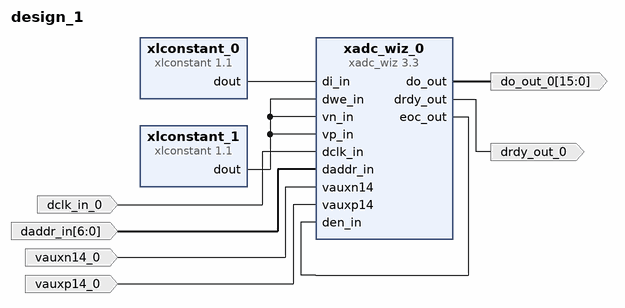
[diagram p0: block diagram of the top level]
# Vivado block design design_1, xc7z020clg400-1, Vivado 2018.2
create_bd_design design_1

create_bd_port -dir I -type clk dclk_in_0
create_bd_port -dir I -from 6 -to 0 daddr_in
create_bd_port -dir I vauxp14_0
create_bd_port -dir I vauxn14_0
create_bd_port -dir O -from 15 -to 0 do_out_0
create_bd_port -dir O drdy_out_0

create_bd_cell -type ip -vlnv xilinx.com:ip:xadc_wiz:3.3 xadc_wiz_0
set_property -dict [list \
  CONFIG.INTERFACE_SELECTION ENABLE_DRP \
  CONFIG.DCLK_FREQUENCY 125 \
  CONFIG.ADC_CONVERSION_RATE 1000 \
  CONFIG.ENABLE_RESET false \
  CONFIG.SINGLE_CHANNEL_SELECTION VAUXP14_VAUXN14 \
  CONFIG.SINGLE_CHANNEL_ACQUISITION_TIME false \
  CONFIG.EXTERNAL_MUX_CHANNEL VP_VN \
  CONFIG.ACQUISITION_TIME 10 \
] [get_bd_cells xadc_wiz_0]
create_bd_cell -type ip -vlnv xilinx.com:ip:xlconstant:1.1 xlconstant_0
set_property -dict {CONFIG.CONST_WIDTH 16} [get_bd_cells xlconstant_0]
create_bd_cell -type ip -vlnv xilinx.com:ip:xlconstant:1.1 xlconstant_1

# ---- connections ----

connect_bd_net -net dclk_in_0_1 [get_bd_ports dclk_in_0] [get_bd_pins xadc_wiz_0/dclk_in]
connect_bd_net [get_bd_pins xlconstant_0/dout] [get_bd_pins xadc_wiz_0/di_in]
connect_bd_net [get_bd_pins xlconstant_1/dout] [get_bd_pins xadc_wiz_0/dwe_in] [get_bd_pins xadc_wiz_0/vn_in] [get_bd_pins xadc_wiz_0/vp_in]
connect_bd_net [get_bd_ports daddr_in] [get_bd_pins xadc_wiz_0/daddr_in]
connect_bd_net -net vauxn14_0_1 [get_bd_ports vauxn14_0] [get_bd_pins xadc_wiz_0/vauxn14]
connect_bd_net -net vauxp14_0_1 [get_bd_ports vauxp14_0] [get_bd_pins xadc_wiz_0/vauxp14]
connect_bd_net [get_bd_pins xadc_wiz_0/do_out] [get_bd_ports do_out_0]
connect_bd_net [get_bd_pins xadc_wiz_0/drdy_out] [get_bd_ports drdy_out_0]
connect_bd_net [get_bd_pins xadc_wiz_0/eoc_out] [get_bd_pins xadc_wiz_0/den_in]

validate_bd_design
save_bd_design
